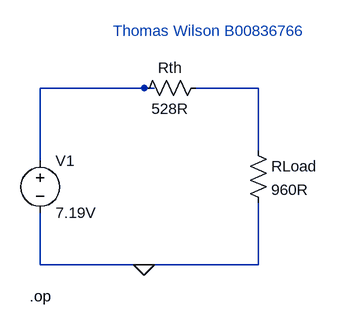
[diagram p0: schematic lab 4 circuit 1.asc]
lab 4 circuit 1.asc, the LTspice schematic file:
Version 4
SHEET 1 880 680
WIRE 160 0 0 0
WIRE 176 0 160 0
WIRE 336 0 240 0
WIRE 336 96 336 0
WIRE 0 112 0 0
WIRE 0 272 0 192
WIRE 160 272 0 272
WIRE 336 272 336 176
WIRE 336 272 160 272
FLAG 160 272 0
DATAFLAG 336 0 ""
DATAFLAG 336 256 "I(Rload)"
SYMBOL voltage 0 96 R0
WINDOW 123 0 0 Left 0
WINDOW 39 0 0 Left 0
SYMATTR InstName V1
SYMATTR Value 7.19V
SYMBOL res 256 -16 R90
WINDOW 0 0 56 VBottom 2
WINDOW 3 32 56 VTop 2
SYMATTR InstName Rth
SYMATTR Value 528R
SYMBOL res 320 80 R0
SYMATTR InstName RLoad
SYMATTR Value 960R
TEXT -16 320 Left 2 !.op
TEXT 112 -88 Left 2 ;Thomas Wilson B00836766

The netlist it stands for:
* lab 4 circuit 1.asc
V1 N001 0 7.19V
Rth N002 N001 528R
RLoad N002 0 960R
.op
* Thomas Wilson B00836766
.backanno
.end